# Altium schematic sheet LED-DRIVER.SchDoc
size A; SheetNumber: 1; SheetTotal: 1
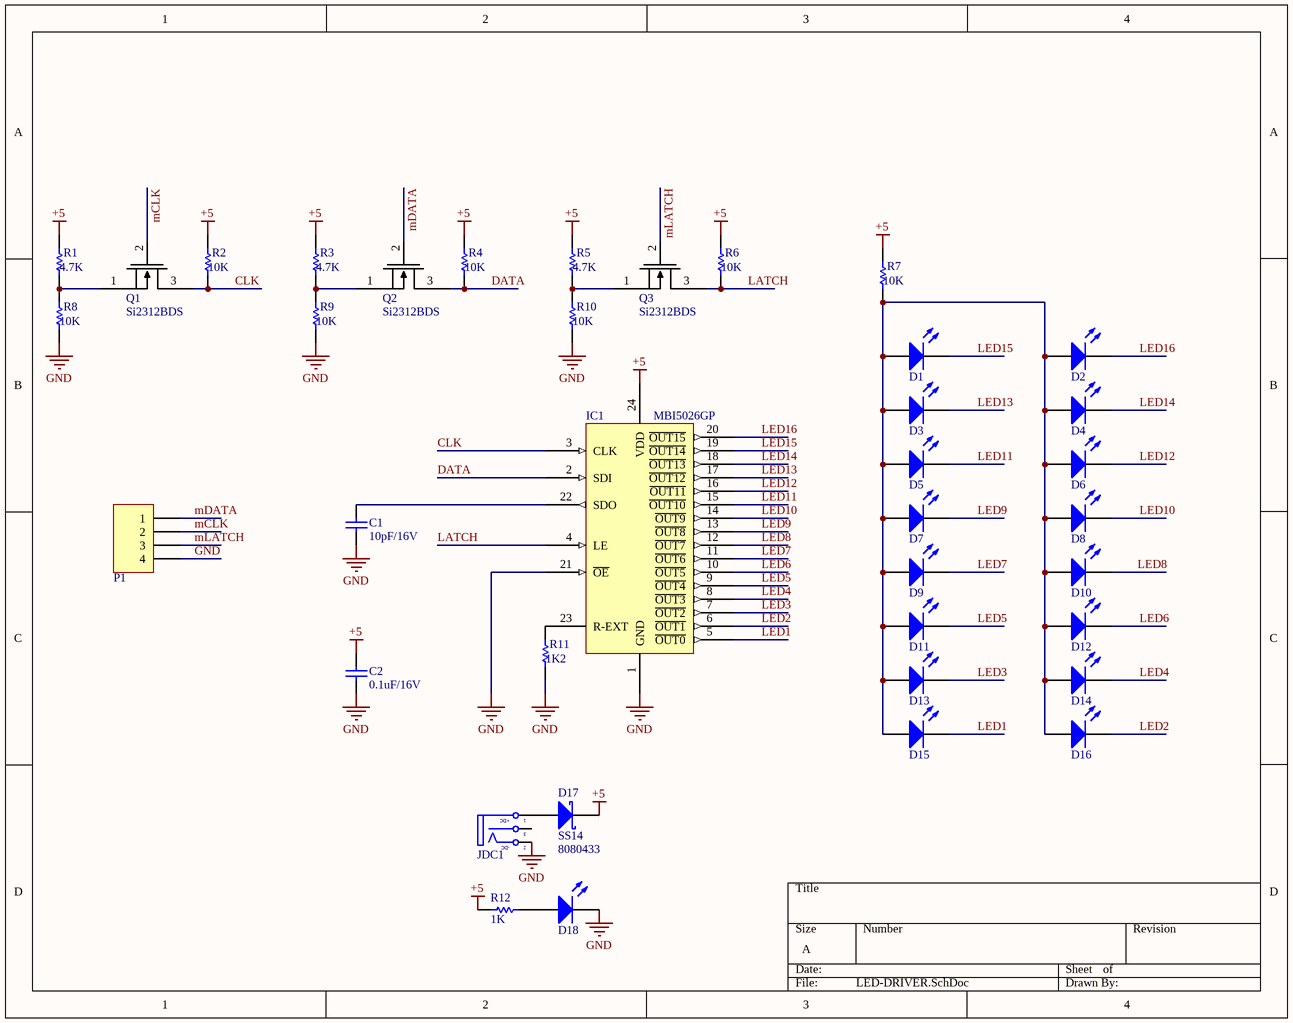
[diagram p0: LED-DRIVER.SchDoc]

## Parts
C1  value 10pF/16V  [CAP-SM-0603]  (hidden comment: Cap Non-Pol SMD)
C2  value 0.1uF/16V  [CAP-SM-0603]  (hidden comment: Cap Non-Pol SMD)
D1  LED SMD  [LED_0603_Blue]  (value not drawn)
D2  LED SMD  [LED_0603_Blue]  (value not drawn)
D3  LED SMD  [LED_0603_Blue]  (value not drawn)
D4  LED SMD  [LED_0603_Blue]  (value not drawn)
D5  LED SMD  [LED_0603_Blue]  (value not drawn)
D6  LED SMD  [LED_0603_Blue]  (value not drawn)
D7  LED SMD  [LED_0603_Blue]  (value not drawn)
D8  LED SMD  [LED_0603_Blue]  (value not drawn)
D9  LED SMD  [LED_0603_Blue]  (value not drawn)
D10  LED SMD  [LED_0603_Blue]  (value not drawn)
D11  LED SMD  [LED_0603_Blue]  (value not drawn)
D12  LED SMD  [LED_0603_Blue]  (value not drawn)
D13  LED SMD  [LED_0603_Blue]  (value not drawn)
D14  LED SMD  [LED_0603_Blue]  (value not drawn)
D15  LED SMD  [LED_0603_Blue]  (value not drawn)
D16  LED SMD  [LED_0603_Blue]  (value not drawn)
D17  Supplier Part Number 1: SS14  Supplier Part Number 2: 8080433  [SS34]  (hidden comment: D Schottky)
D18  LED SMD  [LED_0603_Blue]  (value not drawn)
IC1  MBI5026GP  [MBI5026GP]
JDC1  Jack DC  [DC-IN]  (value not drawn)
P1  Header 4  [JP4]  (value not drawn)
Q1  Si2312BDS  [SOT95P245X110-3N]
Q2  Si2312BDS  [SOT95P245X110-3N]
Q3  Si2312BDS  [SOT95P245X110-3N]
R1  value 4.7K  [RES-SM-0603]  (hidden comment: RESISTOR SMD)
R2  value 10K  [RES-SM-0603]  (hidden comment: RESISTOR SMD)
R3  value 4.7K  [RES-SM-0603]  (hidden comment: RESISTOR SMD)
R4  value 10K  [RES-SM-0603]  (hidden comment: RESISTOR SMD)
R5  value 4.7K  [RES-SM-0603]  (hidden comment: RESISTOR SMD)
R6  value 10K  [RES-SM-0603]  (hidden comment: RESISTOR SMD)
R7  value 10K  [RES-SM-0603]  (hidden comment: RESISTOR SMD)
R8  value 10K  [RES-SM-0603]  (hidden comment: RESISTOR SMD)
R9  value 10K  [RES-SM-0603]  (hidden comment: RESISTOR SMD)
R10  value 10K  [RES-SM-0603]  (hidden comment: RESISTOR SMD)
R11  value 1K2  [RES-SM-0603]  (hidden comment: RESISTOR SMD)
R12  value 1K  [RES-SM-0603]  (hidden comment: RESISTOR SMD)

## Nets
+5: C2.2 D17.K IC1.24(VDD) R1.2 R2.2 R3.2 R4.2 R5.2 R6.2 R7.2 R12.1
GND: C1.1 C2.1 D18.2(K) IC1.1(GND) IC1.21(~{OE}) JDC1.2(TN) P1.4 R8.1 R9.1 R10.1 R11.1
CLK: IC1.3(CLK) Q1.3 R2.1
DATA: IC1.2(SDI) Q2.3 R4.1
LATCH: IC1.4(LE) Q3.3 R6.1
LED1: D15.2(K) IC1.5(~{OUT0})
LED2: D16.2(K) IC1.6(~{OUT1})
LED3: D13.2(K) IC1.7(~{OUT2})
LED4: D14.2(K) IC1.8(~{OUT3})
LED5: D11.2(K) IC1.9(~{OUT4})
LED6: D12.2(K) IC1.10(~{OUT5})
LED7: D9.2(K) IC1.11(~{OUT6})
LED8: D10.2(K) IC1.12(~{OUT7})
LED9: D7.2(K) IC1.13(~{OUT8})
LED10: D8.2(K) IC1.14(~{OUT9})
LED11: D5.2(K) IC1.15(~{OUT10})
LED12: D6.2(K) IC1.16(~{OUT11})
LED13: D3.2(K) IC1.17(~{OUT12})
LED14: D4.2(K) IC1.18(~{OUT13})
LED15: D1.2(K) IC1.19(~{OUT14})
LED16: D2.2(K) IC1.20(~{OUT15})
mCLK: P1.2 Q1.2
mDATA: P1.1 Q2.2
mLATCH: P1.3 Q3.2
NetC1_2: C1.2 IC1.22(SDO)
NetD1_1: D1.1(A) D2.1(A) D3.1(A) D4.1(A) D5.1(A) D6.1(A) D7.1(A) D8.1(A) D9.1(A) D10.1(A) D11.1(A) D12.1(A) D13.1(A) D14.1(A) D15.1(A) D16.1(A) R7.1
NetD17_A: D17.A JDC1.1(T)
NetD18_1: D18.1(A) R12.2
NetIC1_23: IC1.23(R-EXT) R11.2
NetQ1_1: Q1.1 R1.1 R8.2
NetQ2_1: Q2.1 R3.1 R9.2
NetQ3_1: Q3.1 R5.1 R10.2

Not connected (* = marked no-connect by the designer): JDC1 3(S)

## Notes on the sheet
- (in symbol Jack DC) +DC; -DC

## Library data of the parts
C1 C2 = Cap Non-Pol SMD: Capacitor
D1-D16 D18 = LED SMD: LED
D17 = D Schottky: Schottky Diode; Published: 8-Jun-2000; LatestRevisionDate: 17-Jul-2002; LatestRevisionNote: Re-released for DXP Platform.; PackageReference: SMB; Publisher: Altium Limited; PackageDescription: DO-214-AA/SMB; 2 C-Bend Leads; Body 5.3 x 3.6 mm, inc. leads (LxW); Code_JEDEC: DO-214-AA; Supplier 1: Arrow Electronics; Supplier 2: RSComponents
IC1 = MBI5026GP: 16-bit Constant Current LED Sink Driver
JDC1 = Jack DC: Jack DC input; Value: Jac DC
P1 = Header 4: Header, 4-Pin; LatestRevisionDate: 17-Jul-2002; LatestRevisionNote: Re-released for DXP Platform.; Publisher: Altium Limited
Q1-Q3 = Si2312BDS: Manufacturer: Vishay Semiconductors; Manufacturer P/N: SI2312BDS-T1-E3; ComponentLink1Description: Supplier 1 Link; ComponentLink1URL: https://www.mouser.vn/ProductDetail/Vishay-Semiconductors/SI2312BDS-T1-E3/?qs=%2Fha2pyFaduiZW8HKJbgU3%2FZCFULz2JfGTitrLvt62%2FLefe%252B0DX8Hbw%3D%3D; Supplier 1: Mouser; Supplier 1 P/N: 781-SI2312BDS-E3
R1-R12 = RESISTOR SMD: Resistor